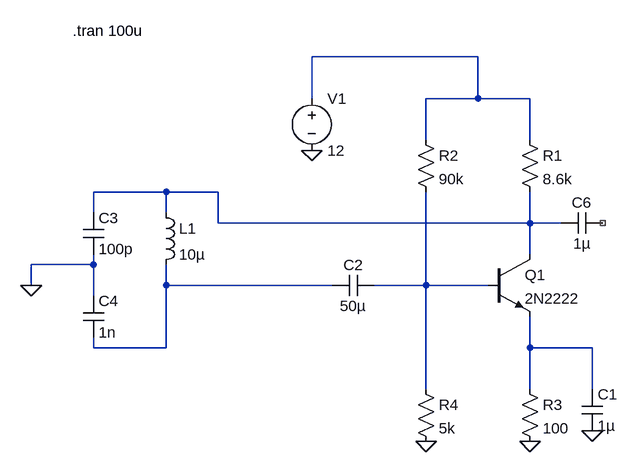
[diagram p0: schematic Project2.asc]
Project2.asc, the LTspice schematic file:
Version 4
SHEET 1 880 680
WIRE 144 -160 -112 -160
WIRE -112 -96 -112 -160
WIRE 144 -96 144 -160
WIRE 144 -96 64 -96
WIRE 224 -96 144 -96
WIRE 64 -32 64 -96
WIRE 224 -32 224 -96
WIRE -336 48 -448 48
WIRE -256 48 -336 48
WIRE -448 80 -448 48
WIRE -336 80 -336 48
WIRE -256 96 -256 48
WIRE 224 96 224 48
WIRE 224 96 -256 96
WIRE 272 96 224 96
WIRE 224 144 224 96
WIRE -448 160 -448 144
WIRE -448 160 -544 160
WIRE -544 192 -544 160
WIRE -336 192 -336 160
WIRE -80 192 -336 192
WIRE 64 192 64 48
WIRE 64 192 -16 192
WIRE 160 192 64 192
WIRE -448 208 -448 160
WIRE -448 288 -448 272
WIRE -336 288 -336 192
WIRE -336 288 -448 288
WIRE 224 288 224 240
WIRE 320 288 224 288
WIRE 64 352 64 192
WIRE 224 352 224 288
WIRE 320 352 320 288
FLAG 64 432 0
FLAG 224 432 0
FLAG 320 416 0
FLAG -112 -16 0
FLAG -544 192 0
DATAFLAG 224 96 ""
DATAFLAG 224 288 ""
DATAFLAG 64 192 ""
SYMBOL npn 160 144 R0
SYMATTR InstName Q1
SYMATTR Value 2N2222
SYMBOL res 208 -48 R0
SYMATTR InstName R1
SYMATTR Value 8.6k
SYMBOL res 48 -48 R0
SYMATTR InstName R2
SYMATTR Value 90k
SYMBOL res 48 336 R0
SYMATTR InstName R4
SYMATTR Value 5k
SYMBOL cap 304 352 R0
SYMATTR InstName C1
SYMATTR Value 1µ
SYMBOL voltage -112 -112 R0
WINDOW 123 0 0 Left 0
WINDOW 39 0 0 Left 0
SYMATTR InstName V1
SYMATTR Value 12
SYMBOL cap 336 80 R90
WINDOW 0 0 32 VBottom 2
WINDOW 3 32 32 VTop 2
SYMATTR InstName C6
SYMATTR Value 1µ
SYMBOL res 208 336 R0
SYMATTR InstName R3
SYMATTR Value 100
SYMBOL cap -464 80 R0
SYMATTR InstName C3
SYMATTR Value 100p
SYMBOL cap -464 208 R0
SYMATTR InstName C4
SYMATTR Value 1n
SYMBOL ind -352 64 R0
SYMATTR InstName L1
SYMATTR Value 10µ
SYMBOL cap -16 176 R90
WINDOW 0 0 32 VBottom 2
WINDOW 3 32 32 VTop 2
SYMATTR InstName C2
SYMATTR Value 50µ
TEXT -480 -200 Left 2 !.tran 100u

The netlist it stands for:
* Project2.asc
Q1 N002 N004 N005 0 2N2222
R1 N001 N002 8.6k
R2 N001 N004 90k
R4 N004 0 5k
C1 N005 0 1µ
V1 N001 0 12
C6 NC_01 N002 1µ
R3 N005 0 100
C3 N002 0 100p
C4 0 N003 1n
L1 N002 N003 10µ
C2 N004 N003 50µ
.model NPN NPN
.model PNP PNP
.lib standard.bjt
.tran 100u
.backanno
.end